# Altium schematic sheet I2C Multiplexer.SchDoc: I2C Master Multiplexer
size 292 x 193 mm; DocumentNumber: 35; SheetNumber: 12; SheetTotal: 28
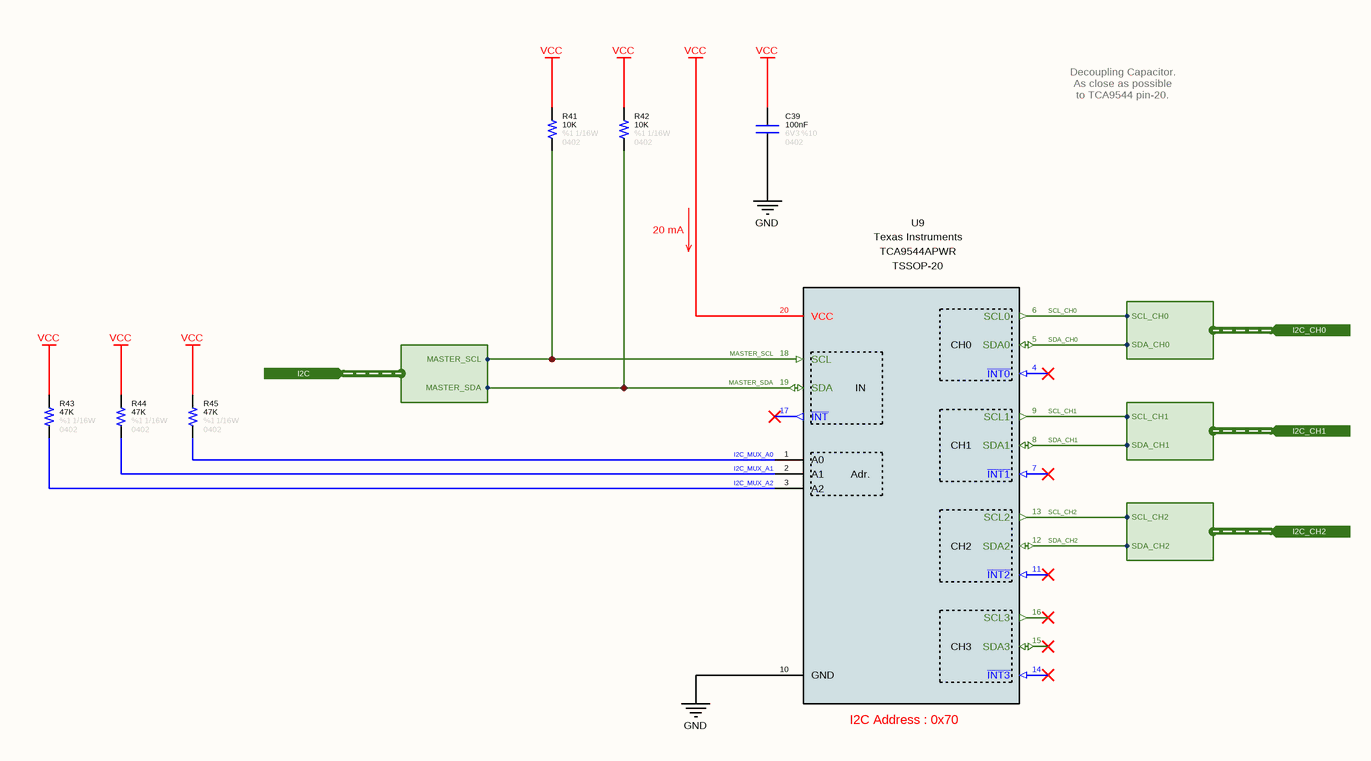
[diagram p0: I2C Multiplexer.SchDoc]

## Parts
C39  value 100nF  Tolerance: %10  Voltage: 6V3  Case: 0402  [CAPACITOR_0402]  (hidden comment: Capacitor - 100nF [0402] (Ceramic))
R41  value 10K  Tolerance: %1  Case: 0402  Power: 1/16W  [RESISTOR_0402]  (hidden comment: 10K - 0402 - %1 - 1/16W)
R42  value 10K  Tolerance: %1  Case: 0402  Power: 1/16W  [RESISTOR_0402]  (hidden comment: 10K - 0402 - %1 - 1/16W)
R43  value 47K  Tolerance: %1  Case: 0402  Power: 1/16W  [RESISTOR_0402]  (hidden comment: 47K - 0402 - %1 - 1/16W)
R44  value 47K  Tolerance: %1  Case: 0402  Power: 1/16W  [RESISTOR_0402]  (hidden comment: 47K - 0402 - %1 - 1/16W)
R45  value 47K  Tolerance: %1  Case: 0402  Power: 1/16W  [RESISTOR_0402]  (hidden comment: 47K - 0402 - %1 - 1/16W)
U9  Manufacturer Name: Texas Instruments  Manufacturer Part Number: TCA9544APWR  [TSSOP-20]  (hidden comment: TCA9548APWR)

## Ports
I2C (in, harness I2C), I2C_CH0 (in, harness I2C_CH0), I2C_CH1 (in, harness I2C_CH1), I2C_CH2 (in, harness I2C_CH2)

## Harnesses
I2C: MASTER_SDA, MASTER_SCL
I2C_CH0: SDA_CH0, SCL_CH0
I2C_CH1: SDA_CH1, SCL_CH1
I2C_CH2: SDA_CH2, SCL_CH2

## Nets
GND: C39.1 U9.10(GND)
VCC: C39.2 R41.2 R42.2 R43.2 R44.2 R45.2 U9.20(VCC)
I2C_MUX_A0: R45.1 U9.1(A0)
I2C_MUX_A1: R44.1 U9.2(A1)
I2C_MUX_A2: R43.1 U9.3(A2)
MASTER_SCL: R41.1 U9.18(SCL) ; port I2C.MASTER_SCL
MASTER_SDA: R42.1 U9.19(SDA) ; port I2C.MASTER_SDA
SCL_CH0: U9.6(SCL0) ; port I2C_CH0.SCL_CH0
SCL_CH1: U9.9(SCL1) ; port I2C_CH1.SCL_CH1
SCL_CH2: U9.13(SCL2) ; port I2C_CH2.SCL_CH2
SDA_CH0: U9.5(SDA0) ; port I2C_CH0.SDA_CH0
SDA_CH1: U9.8(SDA1) ; port I2C_CH1.SDA_CH1
SDA_CH2: U9.12(SDA2) ; port I2C_CH2.SDA_CH2

Not connected (* = marked no-connect by the designer): U9 4(~{INT0})* 7(~{INT1})* 11(~{INT2})* 14(~{INT3})* 15(SDA3)* 16(SCL3)* 17(~{INT})*

## Notes on the sheet
- Decoupling Capacitor. As close as possible to TCA9544 pin-20.
- 20 mA
- (near U9) I2C Address : 0x70
- © 2021 All rights reserved.
  This document may not, in whole or in part, be copied, photocopied, reproduced, translated or converted to any electronic or machine readable from without prior written permission of Mehmet Günce Akkoyun.
  Engineer contact : akkoyun@me.com
- Property of
- Engineer :
- Date :
- Size :
- A4
- Time :
- Project :
- Page :
- /
- Customer :
- Product ID :
- Module ID :
- Version :
- File :
- Revision :
- (in symbol IC - TCA9544A) CH0; IN; CH1; Adr.; CH2; CH3

## Library data of the parts
C39 = Capacitor - 100nF [0402-6V3]: Capacitor - 100nF [0402-6V3] (Ceramic); Manufacturer Name: AVX; Manufacturer Part Number: 04026D104KAT4A; ComponentLink1Description: Mouser; ComponentLink1URL: https://www.mouser.com.tr/ProductDetail/AVX/04026D104KAT4A?qs=sGAEpiMZZMs0AnBnWHyRQPg4iYkCw7IMED%2F4kpqgf7w%3D; ComponentLink2Description: DataSheet; ComponentLink2URL: https://www.mouser.com.tr/datasheet/2/40/cx5r-776519.pdf
R41 R42 = Resistor - 10K [0402]: Thick Film Resistors - SMD 1/16 W 10 KOhm 1%; Manufacturer Name: Vishay; Manufacturer Part Number: CRCW040210K0FKED; ComponentLink1Description: DataSheet; ComponentLink1URL: https://www.mouser.com.tr/datasheet/2/427/dcrcwe3-1762152.pdf; ComponentLink2Description: Mouser; ComponentLink2URL: https://www.mouser.com.tr/ProductDetail/Vishay-Dale/CRCW040210K0FKED?qs=sGAEpiMZZMu61qfTUdNhG2DpbjADlD3GcalbOv9utCY%3D
R43-R45 = Resistor - 47K [0402]: Thick Film Resistors - SMD 1/16 W 47 KOhm 1%; Manufacturer Name: Vishay; Manufacturer Part Number: CRCW040247K0FKED; ComponentLink1Description: DataSheet; ComponentLink1URL: https://www.mouser.com.tr/datasheet/2/427/dcrcwe3-1762152.pdf; ComponentLink2Description: Mouser; ComponentLink2URL: https://www.mouser.com.tr/ProductDetail/Vishay-Dale/CRCW040247K0FKED?qs=sGAEpiMZZMu61qfTUdNhG2DpbjADlD3GL%252B3h1elTxqU%3D
U9 = IC - TCA9544A: TEXAS INSTRUMENTS - TCA9548APWR - I2C SWITCH W/ RESET, 8-CH, TSSOP-24; Channel: 4; Maximum Operating Temperature: + 85 C; Minimum Operating Temperature: - 40 C; Product Type: Switch ICs; Case: TSSOP-20